# Altium project Project-C-V4.PrjPCB (part 3 of 3)

## Sheet BOARD_CONNECTOR.SchDoc
size B
Used 8 times, as channels U_TOP_CONTROLLER/U_BOARD_CONNECTOR1, U_TOP_CONTROLLER/U_BOARD_CONNECTOR2, U_TOP_CONTROLLER/U_BOARD_CONNECTOR3, U_TOP_CONTROLLER/U_BOARD_CONNECTOR4, U_TOP_CONTROLLER/U_BOARD_CONNECTOR5, U_TOP_CONTROLLER/U_BOARD_CONNECTOR6, U_TOP_CONTROLLER/U_BOARD_CONNECTOR7, U_TOP_CONTROLLER/U_BOARD_CONNECTOR8. Parts and nets are listed once, with the designators drawn on the sheet.
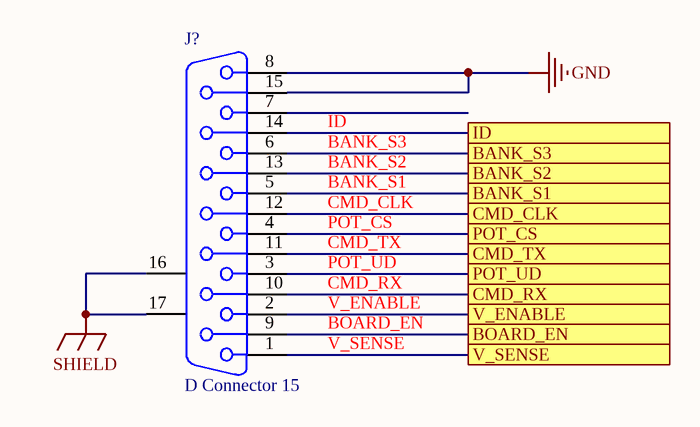
[diagram p12: BOARD_CONNECTOR.SchDoc]

### Parts
J?  D Connector 15  [DSUB1.385-2H15]

### Ports
BANK_S1, BANK_S2, BANK_S3, BOARD_EN, CMD_CLK, CMD_RX, CMD_TX, ID, POT_CS, POT_UD, V_ENABLE, V_SENSE

### Nets
GND: J?.8 J?.15
SHIELD: J?.16(MH1) J?.17(MH2)
BANK_S1: J?.5 ; port BANK_S1
BANK_S2: J?.13 ; port BANK_S2
BANK_S3: J?.6 ; port BANK_S3
BOARD_EN: J?.9 ; port BOARD_EN
CMD_CLK: J?.12 ; port CMD_CLK
CMD_RX: J?.10 ; port CMD_RX
CMD_TX: J?.11 ; port CMD_TX
ID: J?.14 ; port ID
POT_CS: J?.4 ; port POT_CS
POT_UD: J?.3 ; port POT_UD
V_ENABLE: J?.2 ; port V_ENABLE
V_SENSE: J?.1 ; port V_SENSE

Not connected (* = marked no-connect by the designer): J? 7

### Channels
U_TOP_CONTROLLER/U_BOARD_CONNECTOR1: designators end in _U_BOARD_CONNECTOR1; ports BANK_S1=BANK_S1 BANK_S2=BANK_S2 BANK_S3=BANK_S3 BOARD_EN=BOARD_EN CMD_CLK=CMD_CLK CMD_RX=CMD_RX CMD_TX=CMD_TX ID=ID POT_CS=POT_CS POT_UD=POT_UD V_ENABLE=V_ENABLE V_SENSE=V_SENSE
U_TOP_CONTROLLER/U_BOARD_CONNECTOR2: designators end in _U_BOARD_CONNECTOR2; ports BANK_S1=BANK_S1 BANK_S2=BANK_S2 BANK_S3=BANK_S3 BOARD_EN=BOARD_EN CMD_CLK=CMD_CLK CMD_RX=CMD_RX CMD_TX=CMD_TX ID=ID POT_CS=POT_CS POT_UD=POT_UD V_ENABLE=V_ENABLE V_SENSE=V_SENSE
U_TOP_CONTROLLER/U_BOARD_CONNECTOR3: designators end in _U_BOARD_CONNECTOR3; ports BANK_S1=BANK_S1 BANK_S2=BANK_S2 BANK_S3=BANK_S3 BOARD_EN=BOARD_EN CMD_CLK=CMD_CLK CMD_RX=CMD_RX CMD_TX=CMD_TX ID=ID POT_CS=POT_CS POT_UD=POT_UD V_ENABLE=V_ENABLE V_SENSE=V_SENSE
U_TOP_CONTROLLER/U_BOARD_CONNECTOR4: designators end in _U_BOARD_CONNECTOR4; ports BANK_S1=BANK_S1 BANK_S2=BANK_S2 BANK_S3=BANK_S3 BOARD_EN=BOARD_EN CMD_CLK=CMD_CLK CMD_RX=CMD_RX CMD_TX=CMD_TX ID=ID POT_CS=POT_CS POT_UD=POT_UD V_ENABLE=V_ENABLE V_SENSE=V_SENSE
U_TOP_CONTROLLER/U_BOARD_CONNECTOR5: designators end in _U_BOARD_CONNECTOR5; ports BANK_S1=BANK_S1 BANK_S2=BANK_S2 BANK_S3=BANK_S3 BOARD_EN=BOARD_EN CMD_CLK=CMD_CLK CMD_RX=CMD_RX CMD_TX=CMD_TX ID=ID POT_CS=POT_CS POT_UD=POT_UD V_ENABLE=V_ENABLE V_SENSE=V_SENSE
U_TOP_CONTROLLER/U_BOARD_CONNECTOR6: designators end in _U_BOARD_CONNECTOR6; ports BANK_S1=BANK_S1 BANK_S2=BANK_S2 BANK_S3=BANK_S3 BOARD_EN=BOARD_EN CMD_CLK=CMD_CLK CMD_RX=CMD_RX CMD_TX=CMD_TX ID=ID POT_CS=POT_CS POT_UD=POT_UD V_ENABLE=V_ENABLE V_SENSE=V_SENSE
U_TOP_CONTROLLER/U_BOARD_CONNECTOR7: designators end in _U_BOARD_CONNECTOR7; ports BANK_S1=BANK_S1 BANK_S2=BANK_S2 BANK_S3=BANK_S3 BOARD_EN=BOARD_EN CMD_CLK=CMD_CLK CMD_RX=CMD_RX CMD_TX=CMD_TX ID=ID POT_CS=POT_CS POT_UD=POT_UD V_ENABLE=V_ENABLE V_SENSE=V_SENSE
U_TOP_CONTROLLER/U_BOARD_CONNECTOR8: designators end in _U_BOARD_CONNECTOR8; ports BANK_S1=BANK_S1 BANK_S2=BANK_S2 BANK_S3=BANK_S3 BOARD_EN=BOARD_EN CMD_CLK=CMD_CLK CMD_RX=CMD_RX CMD_TX=CMD_TX ID=ID POT_CS=POT_CS POT_UD=POT_UD V_ENABLE=V_ENABLE V_SENSE=V_SENSE

### Library data of the parts
J? = D Connector 15: Receptacle Assembly, 15 Position, Right Angle; PackageDocument: O; Positions: 15; Published: 15-Jun-2001; LatestRevisionDate: 17-Jul-2002; LatestRevisionNote: Re-released for DXP Platform.; DatasheetDocument: 1-Sep-99; PackageReference: 788757; Publisher: Altium Limited; Orientation: Right Angle; Gender: Receptacle

## Nets that join several sheets
CMD_EN: FPGA_IO (C1.1 D1.2 D4.2 U1.2), FPGA_POWER (14 pins), FPGA_CONFIG (R7.1), TOP_VOLTAGE (14 pins), U_TOP_VOLTAGE/VOLT1 (C34_VOLT1.2 U9_VOLT1.3 U9_VOLT1.9), U_TOP_VOLTAGE/VOLT2 (C34_VOLT2.2 U9_VOLT2.3 U9_VOLT2.9), U_TOP_VOLTAGE/VOLT3 (C34_VOLT3.2 U9_VOLT3.3 U9_VOLT3.9), U_TOP_VOLTAGE/VOLT4 (C34_VOLT4.2 U9_VOLT4.3 U9_VOLT4.9), U_TOP_VOLTAGE/VOLT5 (C34_VOLT5.2 U9_VOLT5.3 U9_VOLT5.9), U_TOP_VOLTAGE/VOLT6 (C34_VOLT6.2 U9_VOLT6.3 U9_VOLT6.9), U_TOP_VOLTAGE/VOLT7 (C34_VOLT7.2 U9_VOLT7.3 U9_VOLT7.9), U_TOP_VOLTAGE/VOLT8 (C34_VOLT8.2 U9_VOLT8.3 U9_VOLT8.9), U_TOP_VOLTAGE/VOLT9 (C34_VOLT9.2 U9_VOLT9.3 U9_VOLT9.9), U_TOP_VOLTAGE/VOLT10 (C34_VOLT10.2 U9_VOLT10.3 U9_VOLT10.9), U_TOP_VOLTAGE/VOLT11 (C34_VOLT11.2 U9_VOLT11.3 U9_VOLT11.9), U_TOP_VOLTAGE/VOLT12 (C34_VOLT12.2 U9_VOLT12.3 U9_VOLT12.9), U_TOP_VOLTAGE/VOLT13 (C34_VOLT13.2 U9_VOLT13.3 U9_VOLT13.9), U_TOP_VOLTAGE/VOLT14 (C34_VOLT14.2 U9_VOLT14.3 U9_VOLT14.9), U_TOP_VOLTAGE/VOLT15 (C34_VOLT15.2 U9_VOLT15.3 U9_VOLT15.9), U_TOP_VOLTAGE/VOLT16 (C34_VOLT16.2 U9_VOLT16.3 U9_VOLT16.9), U_TOP_VOLTAGE/VOLT17 (C34_VOLT17.2 U9_VOLT17.3 U9_VOLT17.9), U_TOP_VOLTAGE/VOLT18 (C34_VOLT18.2 U9_VOLT18.3 U9_VOLT18.9), U_TOP_VOLTAGE/VOLT19 (C34_VOLT19.2 U9_VOLT19.3 U9_VOLT19.9), U_TOP_VOLTAGE/VOLT20 (C34_VOLT20.2 U9_VOLT20.3 U9_VOLT20.9), U_TOP_VOLTAGE/VOLT21 (C34_VOLT21.2 U9_VOLT21.3 U9_VOLT21.9), U_TOP_VOLTAGE/VOLT22 (C34_VOLT22.2 U9_VOLT22.3 U9_VOLT22.9), U_TOP_VOLTAGE/VOLT23 (C34_VOLT23.2 U9_VOLT23.3 U9_VOLT23.9), U_TOP_VOLTAGE/VOLT24 (C34_VOLT24.2 U9_VOLT24.3 U9_VOLT24.9), U_TOP_VOLTAGE/VOLT25 (C34_VOLT25.2 U9_VOLT25.3 U9_VOLT25.9), U_TOP_VOLTAGE/VOLT26 (C34_VOLT26.2 U9_VOLT26.3 U9_VOLT26.9), U_TOP_VOLTAGE/VOLT27 (C34_VOLT27.2 U9_VOLT27.3 U9_VOLT27.9), U_TOP_VOLTAGE/VOLT28 (C34_VOLT28.2 U9_VOLT28.3 U9_VOLT28.9), U_TOP_VOLTAGE/VOLT29 (C34_VOLT29.2 U9_VOLT29.3 U9_VOLT29.9), U_TOP_VOLTAGE/VOLT30 (C34_VOLT30.2 U9_VOLT30.3 U9_VOLT30.9), U_TOP_VOLTAGE/VOLT31 (C34_VOLT31.2 U9_VOLT31.3 U9_VOLT31.9), U_TOP_VOLTAGE/VOLT32 (C34_VOLT32.2 U9_VOLT32.3 U9_VOLT32.9), U_TOP_VOLTAGE/VOLT33 (C34_VOLT33.2 U9_VOLT33.3 U9_VOLT33.9), U_TOP_VOLTAGE/VOLT34 (C34_VOLT34.2 U9_VOLT34.3 U9_VOLT34.9), U_TOP_VOLTAGE/VOLT35 (C34_VOLT35.2 U9_VOLT35.3 U9_VOLT35.9), U_TOP_VOLTAGE/VOLT36 (C34_VOLT36.2 U9_VOLT36.3 U9_VOLT36.9), U_TOP_VOLTAGE/VOLT37 (C34_VOLT37.2 U9_VOLT37.3 U9_VOLT37.9), U_TOP_VOLTAGE/VOLT38 (C34_VOLT38.2 U9_VOLT38.3 U9_VOLT38.9), U_TOP_VOLTAGE/VOLT39 (C34_VOLT39.2 U9_VOLT39.3 U9_VOLT39.9), U_TOP_VOLTAGE/VOLT40 (C34_VOLT40.2 U9_VOLT40.3 U9_VOLT40.9), U_TOP_VOLTAGE/VOLT41 (C34_VOLT41.2 U9_VOLT41.3 U9_VOLT41.9), U_TOP_VOLTAGE/VOLT42 (C34_VOLT42.2 U9_VOLT42.3 U9_VOLT42.9), U_TOP_VOLTAGE/VOLT43 (C34_VOLT43.2 U9_VOLT43.3 U9_VOLT43.9), U_TOP_VOLTAGE/VOLT44 (C34_VOLT44.2 U9_VOLT44.3 U9_VOLT44.9), U_TOP_VOLTAGE/VOLT45 (C34_VOLT45.2 U9_VOLT45.3 U9_VOLT45.9), U_TOP_VOLTAGE/VOLT46 (C34_VOLT46.2 U9_VOLT46.3 U9_VOLT46.9), U_TOP_VOLTAGE/VOLT47 (C34_VOLT47.2 U9_VOLT47.3 U9_VOLT47.9), U_TOP_VOLTAGE/VOLT48 (C34_VOLT48.2 U9_VOLT48.3 U9_VOLT48.9), U_TOP_VOLTAGE/VOLT49 (C34_VOLT49.2 U9_VOLT49.3 U9_VOLT49.9), U_TOP_VOLTAGE/VOLT50 (C34_VOLT50.2 U9_VOLT50.3 U9_VOLT50.9), U_TOP_VOLTAGE/VOLT51 (C34_VOLT51.2 U9_VOLT51.3 U9_VOLT51.9), U_TOP_VOLTAGE/VOLT52 (C34_VOLT52.2 U9_VOLT52.3 U9_VOLT52.9), U_TOP_VOLTAGE/VOLT53 (C34_VOLT53.2 U9_VOLT53.3 U9_VOLT53.9), U_TOP_VOLTAGE/VOLT54 (C34_VOLT54.2 U9_VOLT54.3 U9_VOLT54.9), U_TOP_VOLTAGE/VOLT55 (C34_VOLT55.2 U9_VOLT55.3 U9_VOLT55.9), U_TOP_VOLTAGE/VOLT56 (C34_VOLT56.2 U9_VOLT56.3 U9_VOLT56.9), U_TOP_VOLTAGE/VOLT57 (C34_VOLT57.2 U9_VOLT57.3 U9_VOLT57.9), U_TOP_VOLTAGE/VOLT58 (C34_VOLT58.2 U9_VOLT58.3 U9_VOLT58.9), U_TOP_VOLTAGE/VOLT59 (C34_VOLT59.2 U9_VOLT59.3 U9_VOLT59.9), U_TOP_VOLTAGE/VOLT60 (C34_VOLT60.2 U9_VOLT60.3 U9_VOLT60.9), U_TOP_VOLTAGE/VOLT61 (C34_VOLT61.2 U9_VOLT61.3 U9_VOLT61.9), U_TOP_VOLTAGE/VOLT62 (C34_VOLT62.2 U9_VOLT62.3 U9_VOLT62.9), U_TOP_VOLTAGE/VOLT63 (C34_VOLT63.2 U9_VOLT63.3 U9_VOLT63.9), U_TOP_VOLTAGE/VOLT64 (C34_VOLT64.2 U9_VOLT64.3 U9_VOLT64.9), U_TOP_VOLTAGE/VOLT65 (C34_VOLT65.2 U9_VOLT65.3 U9_VOLT65.9), U_TOP_VOLTAGE/VOLT66 (C34_VOLT66.2 U9_VOLT66.3 U9_VOLT66.9), U_TOP_VOLTAGE/VOLT67 (C34_VOLT67.2 U9_VOLT67.3 U9_VOLT67.9), U_TOP_VOLTAGE/VOLT68 (C34_VOLT68.2 U9_VOLT68.3 U9_VOLT68.9), U_TOP_VOLTAGE/VOLT69 (C34_VOLT69.2 U9_VOLT69.3 U9_VOLT69.9), U_TOP_VOLTAGE/VOLT70 (C34_VOLT70.2 U9_VOLT70.3 U9_VOLT70.9), U_TOP_VOLTAGE/VOLT71 (C34_VOLT71.2 U9_VOLT71.3 U9_VOLT71.9), U_TOP_VOLTAGE/VOLT72 (C34_VOLT72.2 U9_VOLT72.3 U9_VOLT72.9), U_TOP_VOLTAGE/VOLT73 (C34_VOLT73.2 U9_VOLT73.3 U9_VOLT73.9), U_TOP_VOLTAGE/VOLT74 (C34_VOLT74.2 U9_VOLT74.3 U9_VOLT74.9), U_TOP_VOLTAGE/VOLT75 (C34_VOLT75.2 U9_VOLT75.3 U9_VOLT75.9), U_TOP_VOLTAGE/VOLT76 (C34_VOLT76.2 U9_VOLT76.3 U9_VOLT76.9), U_TOP_VOLTAGE/VOLT77 (C34_VOLT77.2 U9_VOLT77.3 U9_VOLT77.9), U_TOP_VOLTAGE/VOLT78 (C34_VOLT78.2 U9_VOLT78.3 U9_VOLT78.9), U_TOP_VOLTAGE/VOLT79 (C34_VOLT79.2 U9_VOLT79.3 U9_VOLT79.9), U_TOP_VOLTAGE/VOLT80 (C34_VOLT80.2 U9_VOLT80.3 U9_VOLT80.9), U_TOP_VOLTAGE/VOLT81 (C34_VOLT81.2 U9_VOLT81.3 U9_VOLT81.9), U_TOP_VOLTAGE/VOLT82 (C34_VOLT82.2 U9_VOLT82.3 U9_VOLT82.9), U_TOP_VOLTAGE/VOLT83 (C34_VOLT83.2 U9_VOLT83.3 U9_VOLT83.9), U_TOP_VOLTAGE/VOLT84 (C34_VOLT84.2 U9_VOLT84.3 U9_VOLT84.9), U_TOP_VOLTAGE/VOLT85 (C34_VOLT85.2 U9_VOLT85.3 U9_VOLT85.9), U_TOP_VOLTAGE/VOLT86 (C34_VOLT86.2 U9_VOLT86.3 U9_VOLT86.9), U_TOP_VOLTAGE/VOLT87 (C34_VOLT87.2 U9_VOLT87.3 U9_VOLT87.9), U_TOP_VOLTAGE/VOLT88 (C34_VOLT88.2 U9_VOLT88.3 U9_VOLT88.9), U_TOP_VOLTAGE/VOLT89 (C34_VOLT89.2 U9_VOLT89.3 U9_VOLT89.9), U_TOP_VOLTAGE/VOLT90 (C34_VOLT90.2 U9_VOLT90.3 U9_VOLT90.9), U_TOP_VOLTAGE/VOLT91 (C34_VOLT91.2 U9_VOLT91.3 U9_VOLT91.9), U_TOP_VOLTAGE/VOLT92 (C34_VOLT92.2 U9_VOLT92.3 U9_VOLT92.9), U_TOP_VOLTAGE/VOLT93 (C34_VOLT93.2 U9_VOLT93.3 U9_VOLT93.9), U_TOP_VOLTAGE/VOLT94 (C34_VOLT94.2 U9_VOLT94.3 U9_VOLT94.9), U_TOP_VOLTAGE/VOLT95 (C34_VOLT95.2 U9_VOLT95.3 U9_VOLT95.9), U_TOP_VOLTAGE/VOLT96 (C34_VOLT96.2 U9_VOLT96.3 U9_VOLT96.9), U_TOP_VOLTAGE/VOLT97 (C34_VOLT97.2 U9_VOLT97.3 U9_VOLT97.9), U_TOP_VOLTAGE/VOLT98 (C34_VOLT98.2 U9_VOLT98.3 U9_VOLT98.9), U_TOP_VOLTAGE/VOLT99 (C34_VOLT99.2 U9_VOLT99.3 U9_VOLT99.9), U_TOP_VOLTAGE/VOLT100 (C34_VOLT100.2 U9_VOLT100.3 U9_VOLT100.9), U_TOP_VOLTAGE/VOLT101 (C34_VOLT101.2 U9_VOLT101.3 U9_VOLT101.9), U_TOP_VOLTAGE/VOLT102 (C34_VOLT102.2 U9_VOLT102.3 U9_VOLT102.9), U_TOP_VOLTAGE/VOLT103 (C34_VOLT103.2 U9_VOLT103.3 U9_VOLT103.9), U_TOP_VOLTAGE/VOLT104 (C34_VOLT104.2 U9_VOLT104.3 U9_VOLT104.9), U_TOP_VOLTAGE/VOLT105 (C34_VOLT105.2 U9_VOLT105.3 U9_VOLT105.9), U_TOP_VOLTAGE/VOLT106 (C34_VOLT106.2 U9_VOLT106.3 U9_VOLT106.9), U_TOP_VOLTAGE/VOLT107 (C34_VOLT107.2 U9_VOLT107.3 U9_VOLT107.9), U_TOP_VOLTAGE/VOLT108 (C34_VOLT108.2 U9_VOLT108.3 U9_VOLT108.9), U_TOP_VOLTAGE/VOLT109 (C34_VOLT109.2 U9_VOLT109.3 U9_VOLT109.9), U_TOP_VOLTAGE/VOLT110 (C34_VOLT110.2 U9_VOLT110.3 U9_VOLT110.9), U_TOP_VOLTAGE/VOLT111 (C34_VOLT111.2 U9_VOLT111.3 U9_VOLT111.9), U_TOP_VOLTAGE/VOLT112 (C34_VOLT112.2 U9_VOLT112.3 U9_VOLT112.9), U_TOP_VOLTAGE/VOLT113 (C34_VOLT113.2 U9_VOLT113.3 U9_VOLT113.9), U_TOP_VOLTAGE/VOLT114 (C34_VOLT114.2 U9_VOLT114.3 U9_VOLT114.9), U_TOP_VOLTAGE/VOLT115 (C34_VOLT115.2 U9_VOLT115.3 U9_VOLT115.9), U_TOP_VOLTAGE/VOLT116 (C34_VOLT116.2 U9_VOLT116.3 U9_VOLT116.9), U_TOP_VOLTAGE/VOLT117 (C34_VOLT117.2 U9_VOLT117.3 U9_VOLT117.9), U_TOP_VOLTAGE/VOLT118 (C34_VOLT118.2 U9_VOLT118.3 U9_VOLT118.9), U_TOP_VOLTAGE/VOLT119 (C34_VOLT119.2 U9_VOLT119.3 U9_VOLT119.9), U_TOP_VOLTAGE/VOLT120 (C34_VOLT120.2 U9_VOLT120.3 U9_VOLT120.9), U_TOP_VOLTAGE/VOLT121 (C34_VOLT121.2 U9_VOLT121.3 U9_VOLT121.9), U_TOP_VOLTAGE/VOLT122 (C34_VOLT122.2 U9_VOLT122.3 U9_VOLT122.9), U_TOP_VOLTAGE/VOLT123 (C34_VOLT123.2 U9_VOLT123.3 U9_VOLT123.9), U_TOP_VOLTAGE/VOLT124 (C34_VOLT124.2 U9_VOLT124.3 U9_VOLT124.9), U_TOP_VOLTAGE/VOLT125 (C34_VOLT125.2 U9_VOLT125.3 U9_VOLT125.9), U_TOP_VOLTAGE/VOLT126 (C34_VOLT126.2 U9_VOLT126.3 U9_VOLT126.9), U_TOP_VOLTAGE/VOLT127 (C34_VOLT127.2 U9_VOLT127.3 U9_VOLT127.9), U_TOP_VOLTAGE/VOLT128 (C34_VOLT128.2 U9_VOLT128.3 U9_VOLT128.9), U_TOP_VOLTAGE/VOLT129 (C34_VOLT129.2 U9_VOLT129.3 U9_VOLT129.9), U_TOP_VOLTAGE/VOLT130 (C34_VOLT130.2 U9_VOLT130.3 U9_VOLT130.9), U_TOP_VOLTAGE/VOLT131 (C34_VOLT131.2 U9_VOLT131.3 U9_VOLT131.9), U_TOP_VOLTAGE/VOLT132 (C34_VOLT132.2 U9_VOLT132.3 U9_VOLT132.9), U_TOP_VOLTAGE/VOLT133 (C34_VOLT133.2 U9_VOLT133.3 U9_VOLT133.9), U_TOP_VOLTAGE/VOLT134 (C34_VOLT134.2 U9_VOLT134.3 U9_VOLT134.9), U_TOP_VOLTAGE/VOLT135 (C34_VOLT135.2 U9_VOLT135.3 U9_VOLT135.9), U_TOP_VOLTAGE/VOLT136 (C34_VOLT136.2 U9_VOLT136.3 U9_VOLT136.9), U_TOP_VOLTAGE/VOLT137 (C34_VOLT137.2 U9_VOLT137.3 U9_VOLT137.9), U_TOP_VOLTAGE/VOLT138 (C34_VOLT138.2 U9_VOLT138.3 U9_VOLT138.9), U_TOP_VOLTAGE/VOLT139 (C34_VOLT139.2 U9_VOLT139.3 U9_VOLT139.9), U_TOP_VOLTAGE/VOLT140 (C34_VOLT140.2 U9_VOLT140.3 U9_VOLT140.9), U_TOP_VOLTAGE/VOLT141 (C34_VOLT141.2 U9_VOLT141.3 U9_VOLT141.9), U_TOP_VOLTAGE/VOLT142 (C34_VOLT142.2 U9_VOLT142.3 U9_VOLT142.9), U_TOP_VOLTAGE/VOLT143 (C34_VOLT143.2 U9_VOLT143.3 U9_VOLT143.9), U_TOP_VOLTAGE/VOLT144 (C34_VOLT144.2 U9_VOLT144.3 U9_VOLT144.9), U_TOP_VOLTAGE/VOLT145 (C34_VOLT145.2 U9_VOLT145.3 U9_VOLT145.9), U_TOP_VOLTAGE/VOLT146 (C34_VOLT146.2 U9_VOLT146.3 U9_VOLT146.9), U_TOP_VOLTAGE/VOLT147 (C34_VOLT147.2 U9_VOLT147.3 U9_VOLT147.9), U_TOP_VOLTAGE/VOLT148 (C34_VOLT148.2 U9_VOLT148.3 U9_VOLT148.9), U_TOP_VOLTAGE/VOLT149 (C34_VOLT149.2 U9_VOLT149.3 U9_VOLT149.9), U_TOP_VOLTAGE/VOLT150 (C34_VOLT150.2 U9_VOLT150.3 U9_VOLT150.9), U_TOP_VOLTAGE/VOLT151 (C34_VOLT151.2 U9_VOLT151.3 U9_VOLT151.9), U_TOP_VOLTAGE/VOLT152 (C34_VOLT152.2 U9_VOLT152.3 U9_VOLT152.9), U_TOP_VOLTAGE/VOLT153 (C34_VOLT153.2 U9_VOLT153.3 U9_VOLT153.9), U_TOP_VOLTAGE/VOLT154 (C34_VOLT154.2 U9_VOLT154.3 U9_VOLT154.9), U_TOP_VOLTAGE/VOLT155 (C34_VOLT155.2 U9_VOLT155.3 U9_VOLT155.9), U_TOP_VOLTAGE/VOLT156 (C34_VOLT156.2 U9_VOLT156.3 U9_VOLT156.9), U_TOP_VOLTAGE/VOLT157 (C34_VOLT157.2 U9_VOLT157.3 U9_VOLT157.9), U_TOP_VOLTAGE/VOLT158 (C34_VOLT158.2 U9_VOLT158.3 U9_VOLT158.9), U_TOP_VOLTAGE/VOLT159 (C34_VOLT159.2 U9_VOLT159.3 U9_VOLT159.9), U_TOP_VOLTAGE/VOLT160 (C34_VOLT160.2 U9_VOLT160.3 U9_VOLT160.9), WIFI (17 pins), STM32 (33 pins), SDCARD_FLASH (C28.1 C29.1 J2.6 U5.4), LCD (C57.1 C58.1 LCD1.1 LCD1.40), U_TOP_CONTROLLER/U_BOARD_CONNECTOR1 (J?_U_BOARD_CONNECTOR1.8 J?_U_BOARD_CONNECTOR1.15), U_TOP_CONTROLLER/U_BOARD_CONNECTOR2 (J?_U_BOARD_CONNECTOR2.8 J?_U_BOARD_CONNECTOR2.15), U_TOP_CONTROLLER/U_BOARD_CONNECTOR3 (J?_U_BOARD_CONNECTOR3.8 J?_U_BOARD_CONNECTOR3.15), U_TOP_CONTROLLER/U_BOARD_CONNECTOR4 (J?_U_BOARD_CONNECTOR4.8 J?_U_BOARD_CONNECTOR4.15), U_TOP_CONTROLLER/U_BOARD_CONNECTOR5 (J?_U_BOARD_CONNECTOR5.8 J?_U_BOARD_CONNECTOR5.15), U_TOP_CONTROLLER/U_BOARD_CONNECTOR6 (J?_U_BOARD_CONNECTOR6.8 J?_U_BOARD_CONNECTOR6.15), U_TOP_CONTROLLER/U_BOARD_CONNECTOR7 (J?_U_BOARD_CONNECTOR7.8 J?_U_BOARD_CONNECTOR7.15), U_TOP_CONTROLLER/U_BOARD_CONNECTOR8 (J?_U_BOARD_CONNECTOR8.8 J?_U_BOARD_CONNECTOR8.15)
RESET_N: FPGA_IO (C1.2 U1.1 U1.4), FPGA_POWER (C2.1 L1.1 L3.1), TOP_VOLTAGE (P3.4 U8.5 U13.9 U14.16), WIFI (7 pins), STM32 (33 pins), SDCARD_FLASH (C28.2 C29.2 J2.4 U5.8), LCD (6 pins)
SHIELD: TOP_VOLTAGE (J4.16 J4.17), U_TOP_CONTROLLER/U_BOARD_CONNECTOR1 (J?_U_BOARD_CONNECTOR1.16 J?_U_BOARD_CONNECTOR1.17), U_TOP_CONTROLLER/U_BOARD_CONNECTOR2 (J?_U_BOARD_CONNECTOR2.16 J?_U_BOARD_CONNECTOR2.17), U_TOP_CONTROLLER/U_BOARD_CONNECTOR3 (J?_U_BOARD_CONNECTOR3.16 J?_U_BOARD_CONNECTOR3.17), U_TOP_CONTROLLER/U_BOARD_CONNECTOR4 (J?_U_BOARD_CONNECTOR4.16 J?_U_BOARD_CONNECTOR4.17), U_TOP_CONTROLLER/U_BOARD_CONNECTOR5 (J?_U_BOARD_CONNECTOR5.16 J?_U_BOARD_CONNECTOR5.17), U_TOP_CONTROLLER/U_BOARD_CONNECTOR6 (J?_U_BOARD_CONNECTOR6.16 J?_U_BOARD_CONNECTOR6.17), U_TOP_CONTROLLER/U_BOARD_CONNECTOR7 (J?_U_BOARD_CONNECTOR7.16 J?_U_BOARD_CONNECTOR7.17), U_TOP_CONTROLLER/U_BOARD_CONNECTOR8 (J?_U_BOARD_CONNECTOR8.16 J?_U_BOARD_CONNECTOR8.17)
VCC_IO: FPGA_POWER (17 pins), FPGA_CONFIG (6 pins)
VCC_OUT: U_TOP_VOLTAGE/VOLT1 (C34_VOLT1.1 U9_VOLT1.6), U_TOP_VOLTAGE/VOLT2 (C34_VOLT2.1 U9_VOLT2.6), U_TOP_VOLTAGE/VOLT3 (C34_VOLT3.1 U9_VOLT3.6), U_TOP_VOLTAGE/VOLT4 (C34_VOLT4.1 U9_VOLT4.6), U_TOP_VOLTAGE/VOLT5 (C34_VOLT5.1 U9_VOLT5.6), U_TOP_VOLTAGE/VOLT6 (C34_VOLT6.1 U9_VOLT6.6), U_TOP_VOLTAGE/VOLT7 (C34_VOLT7.1 U9_VOLT7.6), U_TOP_VOLTAGE/VOLT8 (C34_VOLT8.1 U9_VOLT8.6), U_TOP_VOLTAGE/VOLT9 (C34_VOLT9.1 U9_VOLT9.6), U_TOP_VOLTAGE/VOLT10 (C34_VOLT10.1 U9_VOLT10.6), U_TOP_VOLTAGE/VOLT11 (C34_VOLT11.1 U9_VOLT11.6), U_TOP_VOLTAGE/VOLT12 (C34_VOLT12.1 U9_VOLT12.6), U_TOP_VOLTAGE/VOLT13 (C34_VOLT13.1 U9_VOLT13.6), U_TOP_VOLTAGE/VOLT14 (C34_VOLT14.1 U9_VOLT14.6), U_TOP_VOLTAGE/VOLT15 (C34_VOLT15.1 U9_VOLT15.6), U_TOP_VOLTAGE/VOLT16 (C34_VOLT16.1 U9_VOLT16.6), U_TOP_VOLTAGE/VOLT17 (C34_VOLT17.1 U9_VOLT17.6), U_TOP_VOLTAGE/VOLT18 (C34_VOLT18.1 U9_VOLT18.6), U_TOP_VOLTAGE/VOLT19 (C34_VOLT19.1 U9_VOLT19.6), U_TOP_VOLTAGE/VOLT20 (C34_VOLT20.1 U9_VOLT20.6), U_TOP_VOLTAGE/VOLT21 (C34_VOLT21.1 U9_VOLT21.6), U_TOP_VOLTAGE/VOLT22 (C34_VOLT22.1 U9_VOLT22.6), U_TOP_VOLTAGE/VOLT23 (C34_VOLT23.1 U9_VOLT23.6), U_TOP_VOLTAGE/VOLT24 (C34_VOLT24.1 U9_VOLT24.6), U_TOP_VOLTAGE/VOLT25 (C34_VOLT25.1 U9_VOLT25.6), U_TOP_VOLTAGE/VOLT26 (C34_VOLT26.1 U9_VOLT26.6), U_TOP_VOLTAGE/VOLT27 (C34_VOLT27.1 U9_VOLT27.6), U_TOP_VOLTAGE/VOLT28 (C34_VOLT28.1 U9_VOLT28.6), U_TOP_VOLTAGE/VOLT29 (C34_VOLT29.1 U9_VOLT29.6), U_TOP_VOLTAGE/VOLT30 (C34_VOLT30.1 U9_VOLT30.6), U_TOP_VOLTAGE/VOLT31 (C34_VOLT31.1 U9_VOLT31.6), U_TOP_VOLTAGE/VOLT32 (C34_VOLT32.1 U9_VOLT32.6), U_TOP_VOLTAGE/VOLT33 (C34_VOLT33.1 U9_VOLT33.6), U_TOP_VOLTAGE/VOLT34 (C34_VOLT34.1 U9_VOLT34.6), U_TOP_VOLTAGE/VOLT35 (C34_VOLT35.1 U9_VOLT35.6), U_TOP_VOLTAGE/VOLT36 (C34_VOLT36.1 U9_VOLT36.6), U_TOP_VOLTAGE/VOLT37 (C34_VOLT37.1 U9_VOLT37.6), U_TOP_VOLTAGE/VOLT38 (C34_VOLT38.1 U9_VOLT38.6), U_TOP_VOLTAGE/VOLT39 (C34_VOLT39.1 U9_VOLT39.6), U_TOP_VOLTAGE/VOLT40 (C34_VOLT40.1 U9_VOLT40.6), U_TOP_VOLTAGE/VOLT41 (C34_VOLT41.1 U9_VOLT41.6), U_TOP_VOLTAGE/VOLT42 (C34_VOLT42.1 U9_VOLT42.6), U_TOP_VOLTAGE/VOLT43 (C34_VOLT43.1 U9_VOLT43.6), U_TOP_VOLTAGE/VOLT44 (C34_VOLT44.1 U9_VOLT44.6), U_TOP_VOLTAGE/VOLT45 (C34_VOLT45.1 U9_VOLT45.6), U_TOP_VOLTAGE/VOLT46 (C34_VOLT46.1 U9_VOLT46.6), U_TOP_VOLTAGE/VOLT47 (C34_VOLT47.1 U9_VOLT47.6), U_TOP_VOLTAGE/VOLT48 (C34_VOLT48.1 U9_VOLT48.6), U_TOP_VOLTAGE/VOLT49 (C34_VOLT49.1 U9_VOLT49.6), U_TOP_VOLTAGE/VOLT50 (C34_VOLT50.1 U9_VOLT50.6), U_TOP_VOLTAGE/VOLT51 (C34_VOLT51.1 U9_VOLT51.6), U_TOP_VOLTAGE/VOLT52 (C34_VOLT52.1 U9_VOLT52.6), U_TOP_VOLTAGE/VOLT53 (C34_VOLT53.1 U9_VOLT53.6), U_TOP_VOLTAGE/VOLT54 (C34_VOLT54.1 U9_VOLT54.6), U_TOP_VOLTAGE/VOLT55 (C34_VOLT55.1 U9_VOLT55.6), U_TOP_VOLTAGE/VOLT56 (C34_VOLT56.1 U9_VOLT56.6), U_TOP_VOLTAGE/VOLT57 (C34_VOLT57.1 U9_VOLT57.6), U_TOP_VOLTAGE/VOLT58 (C34_VOLT58.1 U9_VOLT58.6), U_TOP_VOLTAGE/VOLT59 (C34_VOLT59.1 U9_VOLT59.6), U_TOP_VOLTAGE/VOLT60 (C34_VOLT60.1 U9_VOLT60.6), U_TOP_VOLTAGE/VOLT61 (C34_VOLT61.1 U9_VOLT61.6), U_TOP_VOLTAGE/VOLT62 (C34_VOLT62.1 U9_VOLT62.6), U_TOP_VOLTAGE/VOLT63 (C34_VOLT63.1 U9_VOLT63.6), U_TOP_VOLTAGE/VOLT64 (C34_VOLT64.1 U9_VOLT64.6), U_TOP_VOLTAGE/VOLT65 (C34_VOLT65.1 U9_VOLT65.6), U_TOP_VOLTAGE/VOLT66 (C34_VOLT66.1 U9_VOLT66.6), U_TOP_VOLTAGE/VOLT67 (C34_VOLT67.1 U9_VOLT67.6), U_TOP_VOLTAGE/VOLT68 (C34_VOLT68.1 U9_VOLT68.6), U_TOP_VOLTAGE/VOLT69 (C34_VOLT69.1 U9_VOLT69.6), U_TOP_VOLTAGE/VOLT70 (C34_VOLT70.1 U9_VOLT70.6), U_TOP_VOLTAGE/VOLT71 (C34_VOLT71.1 U9_VOLT71.6), U_TOP_VOLTAGE/VOLT72 (C34_VOLT72.1 U9_VOLT72.6), U_TOP_VOLTAGE/VOLT73 (C34_VOLT73.1 U9_VOLT73.6), U_TOP_VOLTAGE/VOLT74 (C34_VOLT74.1 U9_VOLT74.6), U_TOP_VOLTAGE/VOLT75 (C34_VOLT75.1 U9_VOLT75.6), U_TOP_VOLTAGE/VOLT76 (C34_VOLT76.1 U9_VOLT76.6), U_TOP_VOLTAGE/VOLT77 (C34_VOLT77.1 U9_VOLT77.6), U_TOP_VOLTAGE/VOLT78 (C34_VOLT78.1 U9_VOLT78.6), U_TOP_VOLTAGE/VOLT79 (C34_VOLT79.1 U9_VOLT79.6), U_TOP_VOLTAGE/VOLT80 (C34_VOLT80.1 U9_VOLT80.6), U_TOP_VOLTAGE/VOLT81 (C34_VOLT81.1 U9_VOLT81.6), U_TOP_VOLTAGE/VOLT82 (C34_VOLT82.1 U9_VOLT82.6), U_TOP_VOLTAGE/VOLT83 (C34_VOLT83.1 U9_VOLT83.6), U_TOP_VOLTAGE/VOLT84 (C34_VOLT84.1 U9_VOLT84.6), U_TOP_VOLTAGE/VOLT85 (C34_VOLT85.1 U9_VOLT85.6), U_TOP_VOLTAGE/VOLT86 (C34_VOLT86.1 U9_VOLT86.6), U_TOP_VOLTAGE/VOLT87 (C34_VOLT87.1 U9_VOLT87.6), U_TOP_VOLTAGE/VOLT88 (C34_VOLT88.1 U9_VOLT88.6), U_TOP_VOLTAGE/VOLT89 (C34_VOLT89.1 U9_VOLT89.6), U_TOP_VOLTAGE/VOLT90 (C34_VOLT90.1 U9_VOLT90.6), U_TOP_VOLTAGE/VOLT91 (C34_VOLT91.1 U9_VOLT91.6), U_TOP_VOLTAGE/VOLT92 (C34_VOLT92.1 U9_VOLT92.6), U_TOP_VOLTAGE/VOLT93 (C34_VOLT93.1 U9_VOLT93.6), U_TOP_VOLTAGE/VOLT94 (C34_VOLT94.1 U9_VOLT94.6), U_TOP_VOLTAGE/VOLT95 (C34_VOLT95.1 U9_VOLT95.6), U_TOP_VOLTAGE/VOLT96 (C34_VOLT96.1 U9_VOLT96.6), U_TOP_VOLTAGE/VOLT97 (C34_VOLT97.1 U9_VOLT97.6), U_TOP_VOLTAGE/VOLT98 (C34_VOLT98.1 U9_VOLT98.6), U_TOP_VOLTAGE/VOLT99 (C34_VOLT99.1 U9_VOLT99.6), U_TOP_VOLTAGE/VOLT100 (C34_VOLT100.1 U9_VOLT100.6), U_TOP_VOLTAGE/VOLT101 (C34_VOLT101.1 U9_VOLT101.6), U_TOP_VOLTAGE/VOLT102 (C34_VOLT102.1 U9_VOLT102.6), U_TOP_VOLTAGE/VOLT103 (C34_VOLT103.1 U9_VOLT103.6), U_TOP_VOLTAGE/VOLT104 (C34_VOLT104.1 U9_VOLT104.6), U_TOP_VOLTAGE/VOLT105 (C34_VOLT105.1 U9_VOLT105.6), U_TOP_VOLTAGE/VOLT106 (C34_VOLT106.1 U9_VOLT106.6), U_TOP_VOLTAGE/VOLT107 (C34_VOLT107.1 U9_VOLT107.6), U_TOP_VOLTAGE/VOLT108 (C34_VOLT108.1 U9_VOLT108.6), U_TOP_VOLTAGE/VOLT109 (C34_VOLT109.1 U9_VOLT109.6), U_TOP_VOLTAGE/VOLT110 (C34_VOLT110.1 U9_VOLT110.6), U_TOP_VOLTAGE/VOLT111 (C34_VOLT111.1 U9_VOLT111.6), U_TOP_VOLTAGE/VOLT112 (C34_VOLT112.1 U9_VOLT112.6), U_TOP_VOLTAGE/VOLT113 (C34_VOLT113.1 U9_VOLT113.6), U_TOP_VOLTAGE/VOLT114 (C34_VOLT114.1 U9_VOLT114.6), U_TOP_VOLTAGE/VOLT115 (C34_VOLT115.1 U9_VOLT115.6), U_TOP_VOLTAGE/VOLT116 (C34_VOLT116.1 U9_VOLT116.6), U_TOP_VOLTAGE/VOLT117 (C34_VOLT117.1 U9_VOLT117.6), U_TOP_VOLTAGE/VOLT118 (C34_VOLT118.1 U9_VOLT118.6), U_TOP_VOLTAGE/VOLT119 (C34_VOLT119.1 U9_VOLT119.6), U_TOP_VOLTAGE/VOLT120 (C34_VOLT120.1 U9_VOLT120.6), U_TOP_VOLTAGE/VOLT121 (C34_VOLT121.1 U9_VOLT121.6), U_TOP_VOLTAGE/VOLT122 (C34_VOLT122.1 U9_VOLT122.6), U_TOP_VOLTAGE/VOLT123 (C34_VOLT123.1 U9_VOLT123.6), U_TOP_VOLTAGE/VOLT124 (C34_VOLT124.1 U9_VOLT124.6), U_TOP_VOLTAGE/VOLT125 (C34_VOLT125.1 U9_VOLT125.6), U_TOP_VOLTAGE/VOLT126 (C34_VOLT126.1 U9_VOLT126.6), U_TOP_VOLTAGE/VOLT127 (C34_VOLT127.1 U9_VOLT127.6), U_TOP_VOLTAGE/VOLT128 (C34_VOLT128.1 U9_VOLT128.6), U_TOP_VOLTAGE/VOLT129 (C34_VOLT129.1 U9_VOLT129.6), U_TOP_VOLTAGE/VOLT130 (C34_VOLT130.1 U9_VOLT130.6), U_TOP_VOLTAGE/VOLT131 (C34_VOLT131.1 U9_VOLT131.6), U_TOP_VOLTAGE/VOLT132 (C34_VOLT132.1 U9_VOLT132.6), U_TOP_VOLTAGE/VOLT133 (C34_VOLT133.1 U9_VOLT133.6), U_TOP_VOLTAGE/VOLT134 (C34_VOLT134.1 U9_VOLT134.6), U_TOP_VOLTAGE/VOLT135 (C34_VOLT135.1 U9_VOLT135.6), U_TOP_VOLTAGE/VOLT136 (C34_VOLT136.1 U9_VOLT136.6), U_TOP_VOLTAGE/VOLT137 (C34_VOLT137.1 U9_VOLT137.6), U_TOP_VOLTAGE/VOLT138 (C34_VOLT138.1 U9_VOLT138.6), U_TOP_VOLTAGE/VOLT139 (C34_VOLT139.1 U9_VOLT139.6), U_TOP_VOLTAGE/VOLT140 (C34_VOLT140.1 U9_VOLT140.6), U_TOP_VOLTAGE/VOLT141 (C34_VOLT141.1 U9_VOLT141.6), U_TOP_VOLTAGE/VOLT142 (C34_VOLT142.1 U9_VOLT142.6), U_TOP_VOLTAGE/VOLT143 (C34_VOLT143.1 U9_VOLT143.6), U_TOP_VOLTAGE/VOLT144 (C34_VOLT144.1 U9_VOLT144.6), U_TOP_VOLTAGE/VOLT145 (C34_VOLT145.1 U9_VOLT145.6), U_TOP_VOLTAGE/VOLT146 (C34_VOLT146.1 U9_VOLT146.6), U_TOP_VOLTAGE/VOLT147 (C34_VOLT147.1 U9_VOLT147.6), U_TOP_VOLTAGE/VOLT148 (C34_VOLT148.1 U9_VOLT148.6), U_TOP_VOLTAGE/VOLT149 (C34_VOLT149.1 U9_VOLT149.6), U_TOP_VOLTAGE/VOLT150 (C34_VOLT150.1 U9_VOLT150.6), U_TOP_VOLTAGE/VOLT151 (C34_VOLT151.1 U9_VOLT151.6), U_TOP_VOLTAGE/VOLT152 (C34_VOLT152.1 U9_VOLT152.6), U_TOP_VOLTAGE/VOLT153 (C34_VOLT153.1 U9_VOLT153.6), U_TOP_VOLTAGE/VOLT154 (C34_VOLT154.1 U9_VOLT154.6), U_TOP_VOLTAGE/VOLT155 (C34_VOLT155.1 U9_VOLT155.6), U_TOP_VOLTAGE/VOLT156 (C34_VOLT156.1 U9_VOLT156.6), U_TOP_VOLTAGE/VOLT157 (C34_VOLT157.1 U9_VOLT157.6), U_TOP_VOLTAGE/VOLT158 (C34_VOLT158.1 U9_VOLT158.6), U_TOP_VOLTAGE/VOLT159 (C34_VOLT159.1 U9_VOLT159.6), U_TOP_VOLTAGE/VOLT160 (C34_VOLT160.1 U9_VOLT160.6)
BANK_S1: STM32 (U6.25), U_TOP_CONTROLLER/U_BOARD_CONNECTOR1 (J?_U_BOARD_CONNECTOR1.5), U_TOP_CONTROLLER/U_BOARD_CONNECTOR2 (J?_U_BOARD_CONNECTOR2.5), U_TOP_CONTROLLER/U_BOARD_CONNECTOR3 (J?_U_BOARD_CONNECTOR3.5), U_TOP_CONTROLLER/U_BOARD_CONNECTOR4 (J?_U_BOARD_CONNECTOR4.5), U_TOP_CONTROLLER/U_BOARD_CONNECTOR5 (J?_U_BOARD_CONNECTOR5.5), U_TOP_CONTROLLER/U_BOARD_CONNECTOR6 (J?_U_BOARD_CONNECTOR6.5), U_TOP_CONTROLLER/U_BOARD_CONNECTOR7 (J?_U_BOARD_CONNECTOR7.5), U_TOP_CONTROLLER/U_BOARD_CONNECTOR8 (J?_U_BOARD_CONNECTOR8.5)
BANK_S2: STM32 (U6.26), U_TOP_CONTROLLER/U_BOARD_CONNECTOR1 (J?_U_BOARD_CONNECTOR1.13), U_TOP_CONTROLLER/U_BOARD_CONNECTOR2 (J?_U_BOARD_CONNECTOR2.13), U_TOP_CONTROLLER/U_BOARD_CONNECTOR3 (J?_U_BOARD_CONNECTOR3.13), U_TOP_CONTROLLER/U_BOARD_CONNECTOR4 (J?_U_BOARD_CONNECTOR4.13), U_TOP_CONTROLLER/U_BOARD_CONNECTOR5 (J?_U_BOARD_CONNECTOR5.13), U_TOP_CONTROLLER/U_BOARD_CONNECTOR6 (J?_U_BOARD_CONNECTOR6.13), U_TOP_CONTROLLER/U_BOARD_CONNECTOR7 (J?_U_BOARD_CONNECTOR7.13), U_TOP_CONTROLLER/U_BOARD_CONNECTOR8 (J?_U_BOARD_CONNECTOR8.13)
BANK_S3: U_TOP_CONTROLLER/U_BOARD_CONNECTOR1 (J?_U_BOARD_CONNECTOR1.6), U_TOP_CONTROLLER/U_BOARD_CONNECTOR2 (J?_U_BOARD_CONNECTOR2.6), U_TOP_CONTROLLER/U_BOARD_CONNECTOR3 (J?_U_BOARD_CONNECTOR3.6), U_TOP_CONTROLLER/U_BOARD_CONNECTOR4 (J?_U_BOARD_CONNECTOR4.6), U_TOP_CONTROLLER/U_BOARD_CONNECTOR5 (J?_U_BOARD_CONNECTOR5.6), U_TOP_CONTROLLER/U_BOARD_CONNECTOR6 (J?_U_BOARD_CONNECTOR6.6), U_TOP_CONTROLLER/U_BOARD_CONNECTOR7 (J?_U_BOARD_CONNECTOR7.6), U_TOP_CONTROLLER/U_BOARD_CONNECTOR8 (J?_U_BOARD_CONNECTOR8.6)
BOARD_EN: U_TOP_CONTROLLER/U_BOARD_CONNECTOR1 (J?_U_BOARD_CONNECTOR1.9), U_TOP_CONTROLLER/U_BOARD_CONNECTOR2 (J?_U_BOARD_CONNECTOR2.9), U_TOP_CONTROLLER/U_BOARD_CONNECTOR3 (J?_U_BOARD_CONNECTOR3.9), U_TOP_CONTROLLER/U_BOARD_CONNECTOR4 (J?_U_BOARD_CONNECTOR4.9), U_TOP_CONTROLLER/U_BOARD_CONNECTOR5 (J?_U_BOARD_CONNECTOR5.9), U_TOP_CONTROLLER/U_BOARD_CONNECTOR6 (J?_U_BOARD_CONNECTOR6.9), U_TOP_CONTROLLER/U_BOARD_CONNECTOR7 (J?_U_BOARD_CONNECTOR7.9), U_TOP_CONTROLLER/U_BOARD_CONNECTOR8 (J?_U_BOARD_CONNECTOR8.9)
BOOT0: WIFI (U10.36), STM32 (R36.1 U6.60)
BOOT1: WIFI (U10.30), STM32 (R35.1 U6.28)
CMD_CLK: STM32 (U6.17), U_TOP_CONTROLLER/U_BOARD_CONNECTOR1 (J?_U_BOARD_CONNECTOR1.12), U_TOP_CONTROLLER/U_BOARD_CONNECTOR2 (J?_U_BOARD_CONNECTOR2.12), U_TOP_CONTROLLER/U_BOARD_CONNECTOR3 (J?_U_BOARD_CONNECTOR3.12), U_TOP_CONTROLLER/U_BOARD_CONNECTOR4 (J?_U_BOARD_CONNECTOR4.12), U_TOP_CONTROLLER/U_BOARD_CONNECTOR5 (J?_U_BOARD_CONNECTOR5.12), U_TOP_CONTROLLER/U_BOARD_CONNECTOR6 (J?_U_BOARD_CONNECTOR6.12), U_TOP_CONTROLLER/U_BOARD_CONNECTOR7 (J?_U_BOARD_CONNECTOR7.12), U_TOP_CONTROLLER/U_BOARD_CONNECTOR8 (J?_U_BOARD_CONNECTOR8.12)
CMD_RX: STM32 (U6.37), U_TOP_CONTROLLER/U_BOARD_CONNECTOR1 (J?_U_BOARD_CONNECTOR1.10), U_TOP_CONTROLLER/U_BOARD_CONNECTOR2 (J?_U_BOARD_CONNECTOR2.10), U_TOP_CONTROLLER/U_BOARD_CONNECTOR3 (J?_U_BOARD_CONNECTOR3.10), U_TOP_CONTROLLER/U_BOARD_CONNECTOR4 (J?_U_BOARD_CONNECTOR4.10), U_TOP_CONTROLLER/U_BOARD_CONNECTOR5 (J?_U_BOARD_CONNECTOR5.10), U_TOP_CONTROLLER/U_BOARD_CONNECTOR6 (J?_U_BOARD_CONNECTOR6.10), U_TOP_CONTROLLER/U_BOARD_CONNECTOR7 (J?_U_BOARD_CONNECTOR7.10), U_TOP_CONTROLLER/U_BOARD_CONNECTOR8 (J?_U_BOARD_CONNECTOR8.10)
CMD_TX: STM32 (U6.38), U_TOP_CONTROLLER/U_BOARD_CONNECTOR1 (J?_U_BOARD_CONNECTOR1.11), U_TOP_CONTROLLER/U_BOARD_CONNECTOR2 (J?_U_BOARD_CONNECTOR2.11), U_TOP_CONTROLLER/U_BOARD_CONNECTOR3 (J?_U_BOARD_CONNECTOR3.11), U_TOP_CONTROLLER/U_BOARD_CONNECTOR4 (J?_U_BOARD_CONNECTOR4.11), U_TOP_CONTROLLER/U_BOARD_CONNECTOR5 (J?_U_BOARD_CONNECTOR5.11), U_TOP_CONTROLLER/U_BOARD_CONNECTOR6 (J?_U_BOARD_CONNECTOR6.11), U_TOP_CONTROLLER/U_BOARD_CONNECTOR7 (J?_U_BOARD_CONNECTOR7.11), U_TOP_CONTROLLER/U_BOARD_CONNECTOR8 (J?_U_BOARD_CONNECTOR8.11)
FLASH_CS: STM32 (U6.9), SDCARD_FLASH (U5.1)
FLASH_MISO: STM32 (U6.35), SDCARD_FLASH (J2.7 U5.2), LCD (LCD1.32)
FLASH_MOSI: STM32 (U6.36), SDCARD_FLASH (J2.3 U5.5), LCD (LCD1.34)
FLASH_NCS: STM32 (U6.54), LCD (LCD1.37)
FLASH_SCK: STM32 (U6.34), SDCARD_FLASH (J2.5 U5.6), LCD (LCD1.33)
FONT_NCS: STM32 (U6.53), LCD (LCD1.36)
ID: U_TOP_CONTROLLER/U_BOARD_CONNECTOR1 (J?_U_BOARD_CONNECTOR1.14), U_TOP_CONTROLLER/U_BOARD_CONNECTOR2 (J?_U_BOARD_CONNECTOR2.14), U_TOP_CONTROLLER/U_BOARD_CONNECTOR3 (J?_U_BOARD_CONNECTOR3.14), U_TOP_CONTROLLER/U_BOARD_CONNECTOR4 (J?_U_BOARD_CONNECTOR4.14), U_TOP_CONTROLLER/U_BOARD_CONNECTOR5 (J?_U_BOARD_CONNECTOR5.14), U_TOP_CONTROLLER/U_BOARD_CONNECTOR6 (J?_U_BOARD_CONNECTOR6.14), U_TOP_CONTROLLER/U_BOARD_CONNECTOR7 (J?_U_BOARD_CONNECTOR7.14), U_TOP_CONTROLLER/U_BOARD_CONNECTOR8 (J?_U_BOARD_CONNECTOR8.14)
LCD_D/C: STM32 (U6.59), LCD (LCD1.25)
LCD_NCS: STM32 (U6.20), LCD (LCD1.23)
LCD_SCK: STM32 (U6.21), LCD (LCD1.24)
LCD_SDCARD_CS: STM32 (U6.44), LCD (LCD1.35)
LCD_SDI: STM32 (U6.23), LCD (LCD1.27)
LCD_SDO: STM32 (U6.22), LCD (LCD1.28)
LCD_TOUCH_CS: STM32 (U6.57), LCD (LCD1.30)
LCD_TOUCH_INTR: STM32 (U6.58), LCD (LCD1.31)
POT_CS: U_TOP_CONTROLLER/U_BOARD_CONNECTOR1 (J?_U_BOARD_CONNECTOR1.4), U_TOP_CONTROLLER/U_BOARD_CONNECTOR2 (J?_U_BOARD_CONNECTOR2.4), U_TOP_CONTROLLER/U_BOARD_CONNECTOR3 (J?_U_BOARD_CONNECTOR3.4), U_TOP_CONTROLLER/U_BOARD_CONNECTOR4 (J?_U_BOARD_CONNECTOR4.4), U_TOP_CONTROLLER/U_BOARD_CONNECTOR5 (J?_U_BOARD_CONNECTOR5.4), U_TOP_CONTROLLER/U_BOARD_CONNECTOR6 (J?_U_BOARD_CONNECTOR6.4), U_TOP_CONTROLLER/U_BOARD_CONNECTOR7 (J?_U_BOARD_CONNECTOR7.4), U_TOP_CONTROLLER/U_BOARD_CONNECTOR8 (J?_U_BOARD_CONNECTOR8.4)
POT_UD: U_TOP_CONTROLLER/U_BOARD_CONNECTOR1 (J?_U_BOARD_CONNECTOR1.3), U_TOP_CONTROLLER/U_BOARD_CONNECTOR2 (J?_U_BOARD_CONNECTOR2.3), U_TOP_CONTROLLER/U_BOARD_CONNECTOR3 (J?_U_BOARD_CONNECTOR3.3), U_TOP_CONTROLLER/U_BOARD_CONNECTOR4 (J?_U_BOARD_CONNECTOR4.3), U_TOP_CONTROLLER/U_BOARD_CONNECTOR5 (J?_U_BOARD_CONNECTOR5.3), U_TOP_CONTROLLER/U_BOARD_CONNECTOR6 (J?_U_BOARD_CONNECTOR6.3), U_TOP_CONTROLLER/U_BOARD_CONNECTOR7 (J?_U_BOARD_CONNECTOR7.3), U_TOP_CONTROLLER/U_BOARD_CONNECTOR8 (J?_U_BOARD_CONNECTOR8.3)
SDCARD_CS: STM32 (U6.10), SDCARD_FLASH (J2.2)
STM_nRST: WIFI (U10.37), STM32 (D6.2)
UART1_RX: WIFI (U10.35), STM32 (U6.43)
UART1_TX: WIFI (U10.34), STM32 (U6.42)
V_ENABLE: U_TOP_CONTROLLER/U_BOARD_CONNECTOR1 (J?_U_BOARD_CONNECTOR1.2), U_TOP_CONTROLLER/U_BOARD_CONNECTOR2 (J?_U_BOARD_CONNECTOR2.2), U_TOP_CONTROLLER/U_BOARD_CONNECTOR3 (J?_U_BOARD_CONNECTOR3.2), U_TOP_CONTROLLER/U_BOARD_CONNECTOR4 (J?_U_BOARD_CONNECTOR4.2), U_TOP_CONTROLLER/U_BOARD_CONNECTOR5 (J?_U_BOARD_CONNECTOR5.2), U_TOP_CONTROLLER/U_BOARD_CONNECTOR6 (J?_U_BOARD_CONNECTOR6.2), U_TOP_CONTROLLER/U_BOARD_CONNECTOR7 (J?_U_BOARD_CONNECTOR7.2), U_TOP_CONTROLLER/U_BOARD_CONNECTOR8 (J?_U_BOARD_CONNECTOR8.2)
V_SENSE: U_TOP_CONTROLLER/U_BOARD_CONNECTOR1 (J?_U_BOARD_CONNECTOR1.1), U_TOP_CONTROLLER/U_BOARD_CONNECTOR2 (J?_U_BOARD_CONNECTOR2.1), U_TOP_CONTROLLER/U_BOARD_CONNECTOR3 (J?_U_BOARD_CONNECTOR3.1), U_TOP_CONTROLLER/U_BOARD_CONNECTOR4 (J?_U_BOARD_CONNECTOR4.1), U_TOP_CONTROLLER/U_BOARD_CONNECTOR5 (J?_U_BOARD_CONNECTOR5.1), U_TOP_CONTROLLER/U_BOARD_CONNECTOR6 (J?_U_BOARD_CONNECTOR6.1), U_TOP_CONTROLLER/U_BOARD_CONNECTOR7 (J?_U_BOARD_CONNECTOR7.1), U_TOP_CONTROLLER/U_BOARD_CONNECTOR8 (J?_U_BOARD_CONNECTOR8.1)